# Altium schematic sheet Top.SchDoc
size A
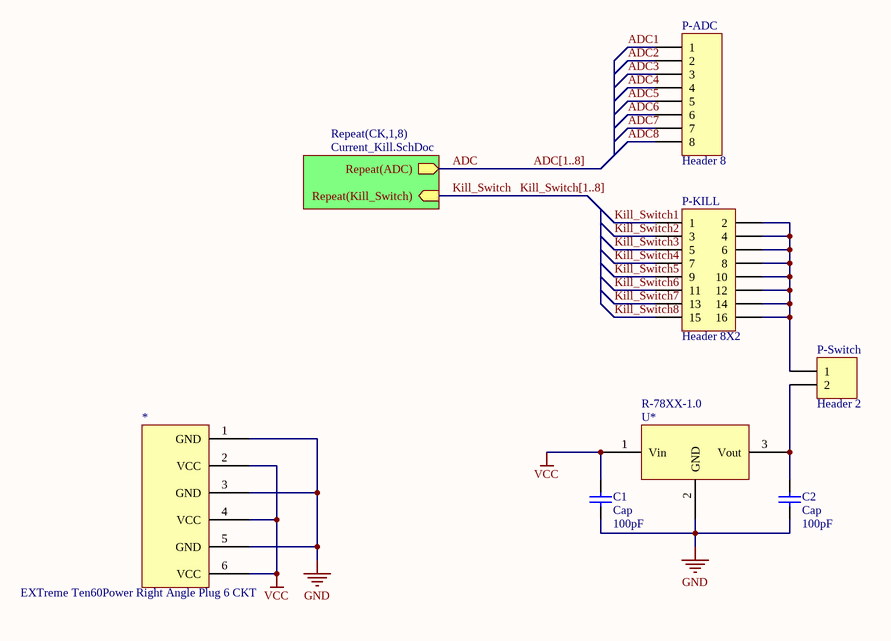
[diagram p0: Top.SchDoc]

## Parts
*  EXTreme Ten60Power Right Angle Plug 6 CKT  [EXTreme Ten60Power Right Angle Plug 6 CKT]
C1  Cap  value 100pF  [1608[0603]]
C2  Cap  value 100pF  [1608[0603]]
P-ADC  Header 8  [HDR1X8]
P-KILL  Header 8X2  [HDR2X8]
P-Switch  Header 2  [HDR1X2]
U*  R-78XX-1.0  [R-785.0-1.0]

## Sub-sheets
Repeat(CK,1,8) = Current_Kill.SchDoc: Repeat(Kill_Switch) (in), Repeat(ADC) (out)

## Nets
GND: *.1(GND) *.3(GND) *.5(GND) C1.1 C2.1 U*.2(GND)
VCC: *.2(VCC) *.4(VCC) *.6(VCC) C1.2 U*.1(Vin)
ADC: sheet Repeat(CK,1,8)/Repeat(ADC)
ADC1: P-ADC.1
ADC2: P-ADC.2
ADC3: P-ADC.3
ADC4: P-ADC.4
ADC5: P-ADC.5
ADC6: P-ADC.6
ADC7: P-ADC.7
ADC8: P-ADC.8
Kill_Switch: sheet Repeat(CK,1,8)/Repeat(Kill_Switch)  [also labelled Kill_Switch[1..8]]
Kill_Switch1: P-KILL.1
Kill_Switch2: P-KILL.3
Kill_Switch3: P-KILL.5
Kill_Switch4: P-KILL.7
Kill_Switch5: P-KILL.9
Kill_Switch6: P-KILL.11
Kill_Switch7: P-KILL.13
Kill_Switch8: P-KILL.15
NetC2_2: C2.2 P-Switch.2 U*.3(Vout)
NetP-KILL_2: P-KILL.2 P-KILL.4 P-KILL.6 P-KILL.8 P-KILL.10 P-KILL.12 P-KILL.14 P-KILL.16 P-Switch.1

## Buses and harness runs
bus ADC[1..8]

## Library data of the parts
C1 C2 = Cap: Capacitor; Published: 8-Jun-2000; LatestRevisionDate: 17-Jul-2002; LatestRevisionNote: Re-released for DXP Platform.; PackageReference: RAD-0.3; Publisher: Altium Limited; PackageDescription: Radial Cap, Thru-Hole; 2 Leads; 0.3 in Pin Spacing
P-ADC = Header 8: Header, 8-Pin; LatestRevisionDate: 17-Jul-2002; LatestRevisionNote: Re-released for DXP Platform.; Publisher: Altium Limited
P-KILL = Header 8X2: Header, 8-Pin, Dual row; LatestRevisionDate: 17-Jul-2002; LatestRevisionNote: Re-released for DXP Platform.; Publisher: Altium Limited
P-Switch = Header 2: Header, 2-Pin; LatestRevisionDate: 17-Jul-2002; LatestRevisionNote: Re-released for DXP Platform.; Publisher: Altium Limited